# EasyEDA schematic SCH_ReTOoric_2025-10-21.json
TITLE: ReToric; REV: 1.0; Date: 2025-04-29; Sheet: 1/1; Drawn By: claireb46
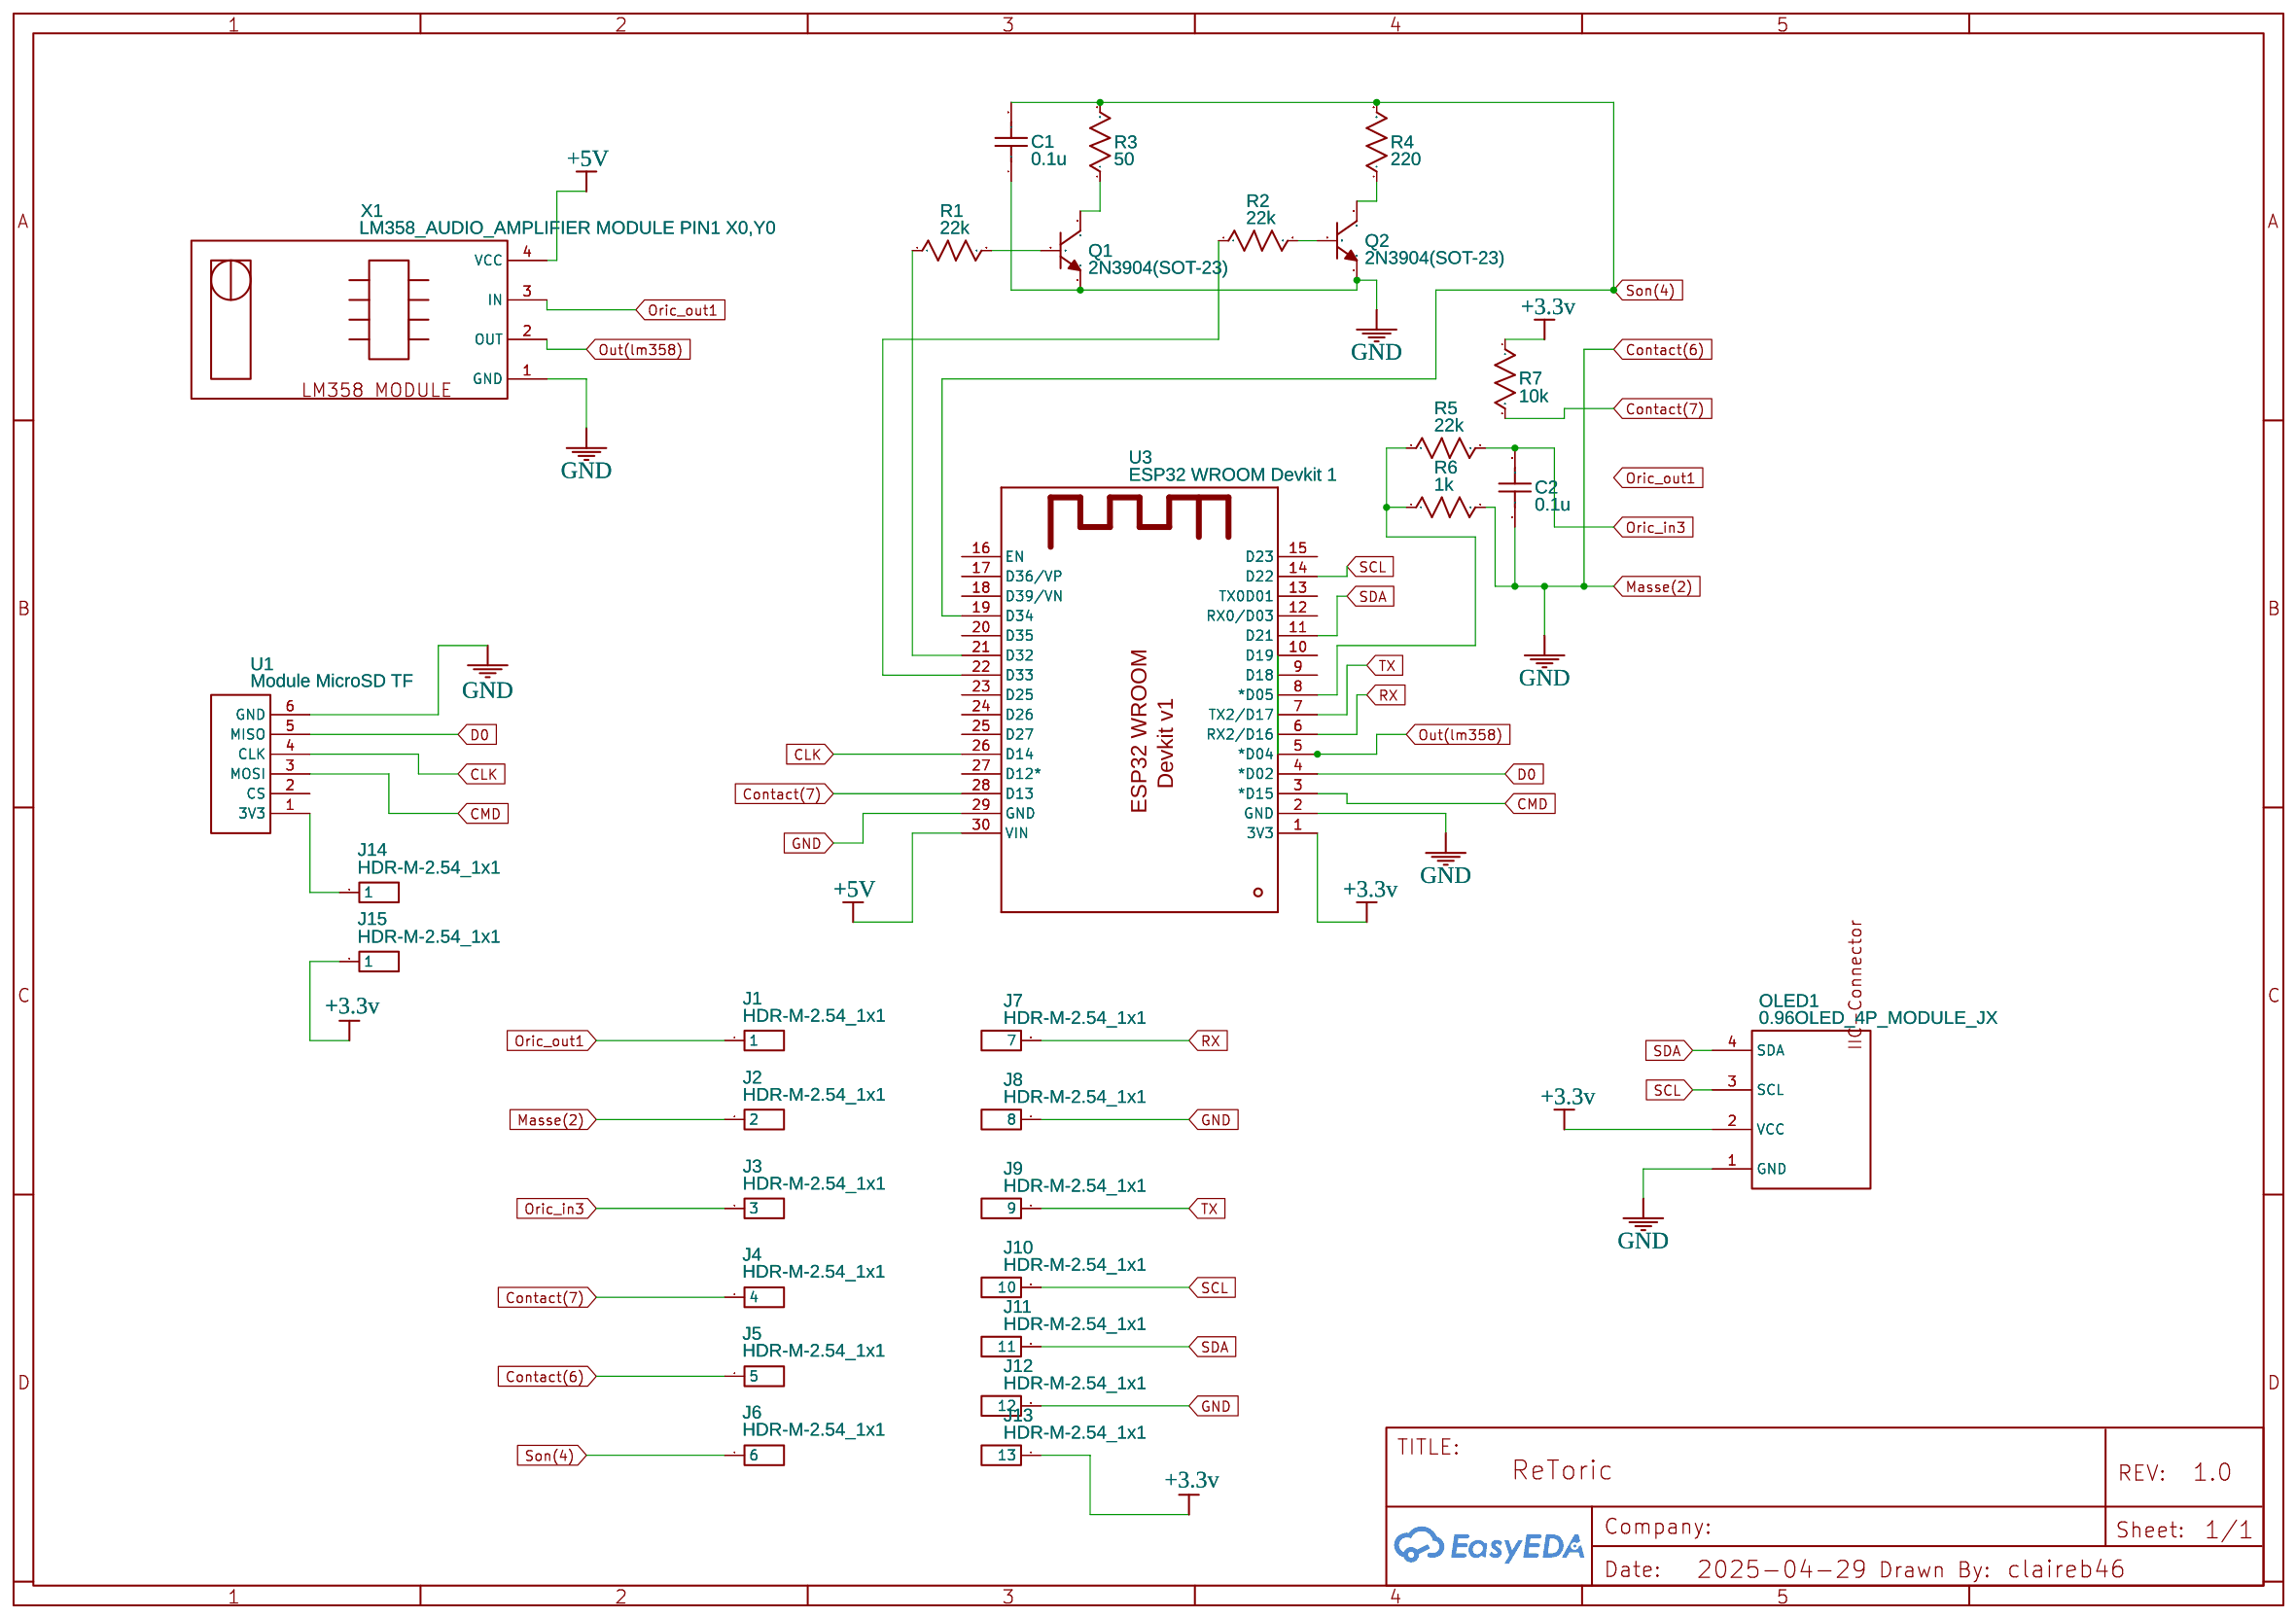
[diagram p0: schematic sheet]

## Parts
C1  0.1u  [C0603]
C2  0.1u  [C0603]
J1  HDR-M-2.54_1x1  [HDR-M-2.54_1X1]
J2  HDR-M-2.54_1x1  [HDR-M-2.54_1X1]
J3  HDR-M-2.54_1x1  [HDR-M-2.54_1X1]
J4  HDR-M-2.54_1x1  [HDR-M-2.54_1X1]
J5  HDR-M-2.54_1x1  [HDR-M-2.54_1X1]
J6  HDR-M-2.54_1x1  [HDR-M-2.54_1X1]
J7  HDR-M-2.54_1x1  [HDR-M-2.54_1X1]
J8  HDR-M-2.54_1x1  [HDR-M-2.54_1X1]
J9  HDR-M-2.54_1x1  [HDR-M-2.54_1X1]
J10  HDR-M-2.54_1x1  [HDR-M-2.54_1X1]
J11  HDR-M-2.54_1x1  [HDR-M-2.54_1X1]
J12  HDR-M-2.54_1x1  [HDR-M-2.54_1X1]
J13  HDR-M-2.54_1x1  [HDR-M-2.54_1X1]
J14  HDR-M-2.54_1x1  [HDR-M-2.54_1X1]
J15  HDR-M-2.54_1x1  [HDR-M-2.54_1X1]
OLED1  0.96OLED_4P_MODULE_JX  [0.96OLED_4P]
Q1  2N3904(SOT-23)  [SOT-23-3_L2.9-W1.3-P1.90-LS2.4-TR]
Q2  2N3904(SOT-23)  [SOT-23-3_L2.9-W1.3-P1.90-LS2.4-TR]
R1  22k  [R0603]
R2  22k  [R0603]
R3  50  [R0603]
R4  220  [R0603]
R5  22k  [R0603]
R6  1k  [R0603]
R7  10k  [R0603]
U1  Module MicroSD TF  [MODULE MICROSD TF]
U3  ESP32 WROOM Devkit 1  [ESP32-DEVKITV1]
X1  LM358_AUDIO_AMPLIFIER MODULE PIN1 X0,Y0  [LM358_AUDIO_AMPLIFIER_MODULE 0X,0Y]

## Library data of the parts
C1 C2 = C_0603_US: Contributor: LCEDA_Lib
J1-J15 = HDR-M-2.54_1x1: Supplier Part: C81276; Supplier: LCSC; Contributor: LCEDA_Lib
OLED1 = 0.96OLED_4P_MODULE_JX: Contributor: LCSC; Supplier: LCSC; Supplier Part: C9900004566; Manufacturer: null; JLCPCB Part Class: Extended Part
Q1 Q2 = 2N3904(SOT-23): Supplier: LCSC; Manufacturer: KEC; Manufacturer Part: 2n3904S-RTK/PS; Supplier Part: C18536; Paste Type: SOT-23; Contributor: LCEDA_Lib
R1-R7 = R_0603_US: Contributor: LCEDA_Lib
U1 = Module MicroSD TF: Manufacturer: SZHAD Technology Store; Manufacturer Part: TF Micro SD Card Module; Supplier: Aliexpress; Supplier Part: Couleur: No Welding; link: https://fr.aliexpress.com/item/1005005302035188.html?spm=a2g0o.productlist.main.13.38ee3bb1Ma2R7J&algo_pvid=9acbad1e-5a0f-4c98-9471-f946ed291f4b&algo_exp_id=9acbad1e-5a0f-4c98-9471-f946ed291f4b-6&pdp_ext_f=%7B%22order%22%3A%221859%22%2C%22eval%22%3A%221%22%7D&pdp_npi=4%40dis%21CAD%211.36%211.36%21%21%210.93%210.93%21%402103201917393064762016325e5adc%2112000032551641256%21sea%21CA%210%21ABX&curPageLogUid=YZKz696dQJwO&utparam-url=scene%3Asearch%7Cquery_from%3A; Contributor: liamlebrun; Price: 1.36
U3 = ESP32 WROOM Devkit 1: Contributor: Qba; Manufacturer: Espresssif
X1 = LM358_AUDIO_AMPLIFIER MODULE PIN1 X0,Y0: Manufacturer Part: 4mm cable to pcb concector 2pins; Contributor: capsule5000

## Nets
+3.3v: J13.1(13) J15.1 OLED1.2(VCC) R7.1 U3.1(3V3)
+5V: U3.30(VIN) X1.4(VCC)
CLK: U1.4(CLK) U3.26(D14)
CMD: U1.3(MOSI) U3.3(*D15)
Contact(6): C1.1 C2.1 J2.1(2) J5.1(5) J8.1(8) J12.1(12) OLED1.1(GND) Q1.1(E) Q2.1(E) R6.2 U1.6(GND) U3.2(GND) U3.29(GND) X1.1(GND)
Contact(7): J4.1(4) R7.2 U3.28(D13)
D0: U1.5(MISO) U3.4(*D02)
Oric_in3: C2.2 J3.1(3) R5.2
Oric_out1: J1.1 X1.3(IN)
Out(lm358): U3.5(*D04) X1.2(OUT)
RX: J7.1(7) U3.6(RX2/D16)
SCL: J10.1(10) OLED1.3(SCL) U3.14(D22)
SDA: J11.1(11) OLED1.4(SDA) U3.11(D21)
Son(4): C1.2 J6.1(6) R3.2 R4.2 U3.19(D34)
TX: J9.1(9) U3.7(TX2/D17)
Net-(J14-1): J14.1 U1.1(3V3)
Net-(Q1-2): Q1.2(B) R1.2
Net-(Q1-3): Q1.3(C) R3.1
Net-(Q2-2): Q2.2(B) R2.2
Net-(Q2-3): Q2.3(C) R4.1
Net-(R1-1): R1.1 U3.21(D32)
Net-(R2-1): R2.1 U3.22(D33)
Net-(R5-1): R5.1 R6.1 U3.8(*D05)

Not connected (* = marked no-connect by the designer): U1 2(CS); U3 9(D18) 10(D19) 12(RX0/D03) 13(TX0D01) 15(D23) 16(EN) 17(D36/VP) 18(D39/VN) 20(D35) 23(D25) 24(D26) 25(D27) 27(D12*)
